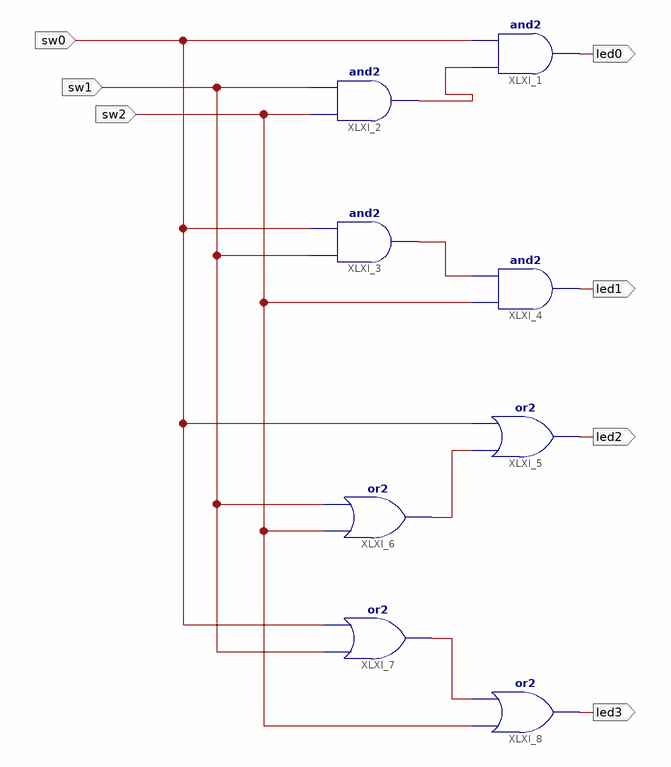
[diagram p0: schematic sheet 1]
// Xilinx ISE schematic asszoc.sch (artix7) as structural Verilog: 8 symbols, 7 ports
module asszoc (
  input  sw0,
  input  sw1,
  input  sw2,
  output led0,
  output led1,
  output led2,
  output led3
);

  wire XLXN_2, XLXN_3, XLXN_4, XLXN_5;

  and XLXI_1 (led0, XLXN_2, sw0);
  and XLXI_2 (XLXN_2, sw2, sw1);
  and XLXI_3 (XLXN_3, sw1, sw0);
  and XLXI_4 (led1, sw2, XLXN_3);
  or XLXI_5 (led2, XLXN_4, sw0);
  or XLXI_6 (XLXN_4, sw2, sw1);
  or XLXI_7 (XLXN_5, sw1, sw0);
  or XLXI_8 (led3, sw2, XLXN_5);
endmodule
